# EAGLE design SAO_Genie (EAGLE 7.7.0)
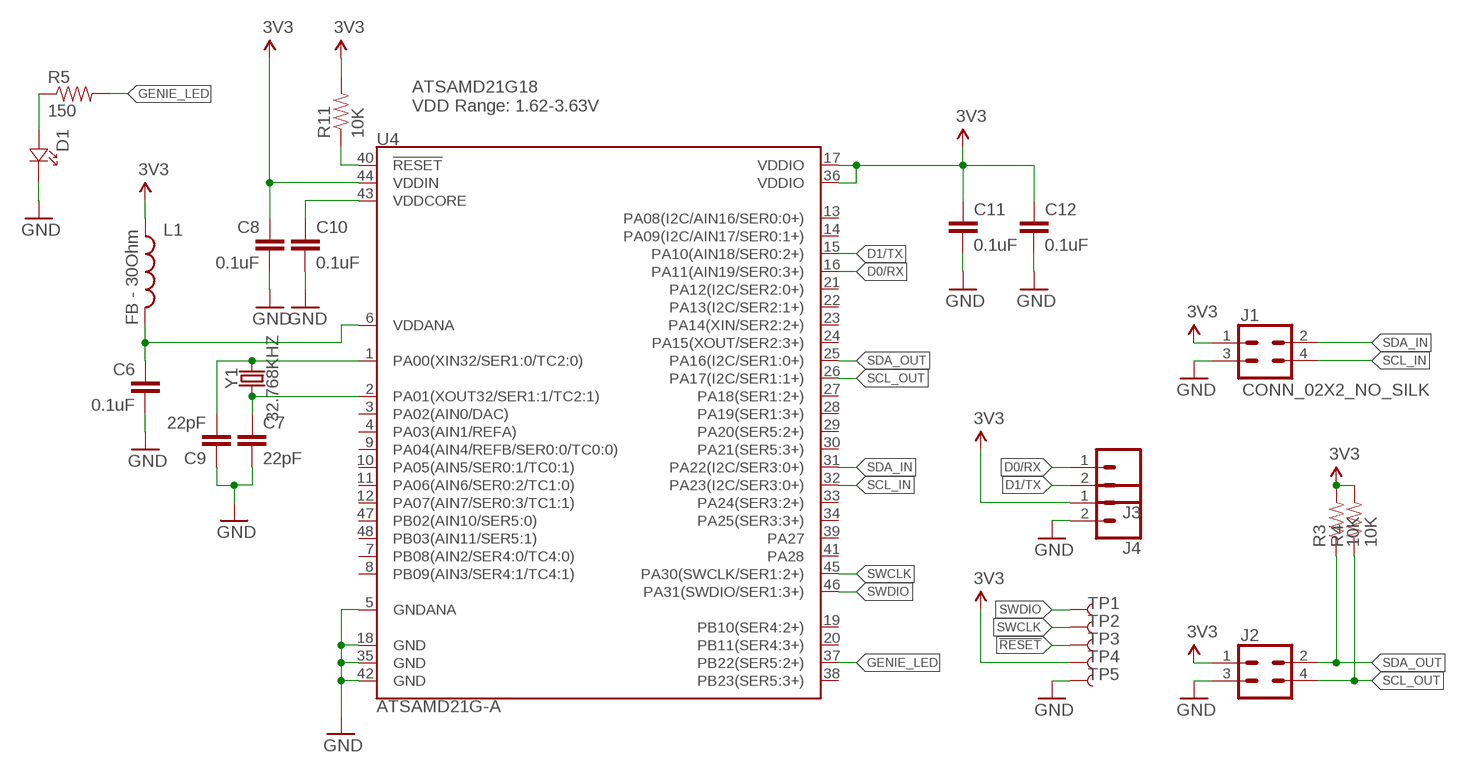
[diagram p0: schematic, sheet 1]

## Parts
C6  0.1uF  0.1UF-25V(+80/-20%)(0603)  [0603-CAP]
C7  22pF  15PF-50V-5%(0603)  [0603-CAP]
C8  0.1uF  0.1UF-25V(+80/-20%)(0603)  [0603-CAP]
C9  22pF  15PF-50V-5%(0603)  [0603-CAP]
C10  0.1uF  0.1UF-25V(+80/-20%)(0603)  [0603-CAP]
C11  0.1uF  0.1UF-25V(+80/-20%)(0603)  [0603-CAP]
C12  0.1uF  0.1UF-25V(+80/-20%)(0603)  [0603-CAP]
D1  LED1206REVERSE_NO_SILK  [1206_NO_SILK]
J1  CONN_02X2_NO_SILK  [2X2_NO_SILK]
J2  SAO OUT  CONN_02X2_NO_SILK  [2X2_NO_SILK]
J3  CONN_021X02_NO_SILK  [1X02_NO_SILK]
J4  CONN_021X02_NO_SILK  [1X02_NO_SILK]
L1  FB - 30Ohm  INDUCTOR0603  [0603]
R3  10K  10KOHM-1/10W-1%(0603)0603  [0603-RES]
R4  10K  10KOHM-1/10W-1%(0603)0603  [0603-RES]
R5  150  10KOHM-1/10W-1%(0603)0603  [0603-RES]
R11  10K  10KOHM-1/10W-1%(0603)0603  [0603-RES]
TP1  TEST-POINT3X5  [PAD.03X.05]
TP2  TEST-POINT3X5  [PAD.03X.05]
TP3  TEST-POINT3X5  [PAD.03X.05]
TP4  TEST-POINT3X5  [PAD.03X.05]
TP5  TEST-POINT3X5  [PAD.03X.05]
U4  ATSAMD21G-A  [TQFP-48]
Y1  32.768KHZ  ABS06-127-32.768KHZ  [ABS06]

## Nets
3.3V: C8.1 C11.1 C12.1 J1.1 J2.1 J4.1 L1.1 R3.2 R4.2 R11.2 TP4.P$1 U4.17(VDDIO) U4.36(VDDIO) U4.44(VDDIN) ; supply symbol labelled 3V3
!RESET: R11.1 TP3.P$1 U4.40(!RESET!)
D0/RX: J3.1 U4.16(PA11(AIN19/SER0:3+))
D1/TX: J3.2 U4.15(PA10(AIN18/SER0:2+))
GENIE_LED: R5.2 U4.37(PB22(SER5:2+))
GND: C6.2 C7.2 C8.2 C9.1 C10.2 C11.2 C12.2 D1.P$1 J1.3 J2.3 J4.2 TP5.P$1 U4.5(GNDANA) U4.18(GND) U4.35(GND) U4.42(GND)
N$2: C7.1 U4.2(PA01(XOUT32/SER1:1/TC2:1)) Y1.P$1
N$5: D1.P$2 R5.1
N$9: C9.2 U4.1(PA00(XIN32/SER1:0/TC2:0)) Y1.P$2
SCL_IN: J1.4 U4.32(PA23(I2C/SER3:0+))
SCL_OUT: J2.4 R4.1 U4.26(PA17(I2C/SER1:1+))
SDA_IN: J1.2 U4.31(PA22(I2C/SER3:0+))
SDA_OUT: J2.2 R3.1 U4.25(PA16(I2C/SER1:0+))
SWCLK: TP2.P$1 U4.45(PA30(SWCLK/SER1:2+))
SWDIO: TP1.P$1 U4.46(PA31(SWDIO/SER1:3+))
VDDANA: C6.1 L1.2 U4.6(VDDANA)
VDDCORE: C10.1 U4.43(VDDCORE)
Unconnected: U4.3(PA02(AIN0/DAC)) U4.4(PA03(AIN1/REFA)) U4.7(PB08(AIN2/SER4:0/TC4:0)) U4.8(PB09(AIN3/SER4:1/TC4:1)) U4.9(PA04(AIN4/REFB/SER0:0/TC0:0)) U4.10(PA05(AIN5/SER0:1/TC0:1)) U4.11(PA06(AIN6/SER0:2/TC1:0)) U4.12(PA07(AIN7/SER0:3/TC1:1)) U4.13(PA08(I2C/AIN16/SER0:0+)) U4.14(PA09(I2C/AIN17/SER0:1+)) U4.19(PB10(SER4:2+)) U4.20(PB11(SER4:3+)) U4.21(PA12(I2C/SER2:0+)) U4.22(PA13(I2C/SER2:1+)) U4.23(PA14(XIN/SER2:2+)) U4.24(PA15(XOUT/SER2:3+)) U4.27(PA18(SER1:2+)) U4.28(PA19(SER1:3+)) U4.29(PA20(SER5:2+)) U4.30(PA21(SER5:3+)) U4.33(PA24(SER3:2+)) U4.34(PA25(SER3:3+)) U4.38(PB23(SER5:3+)) U4.39(PA27) U4.41(PA28) U4.47(PB02(AIN10/SER5:0)) U4.48(PB03(AIN11/SER5:1))

## Notes on the sheet
- ATSAMD21G18
  VDD Range: 1.62-3.63V

## Library data of the parts
C6 C8 C10-C12 = SparkFun-Capacitors:0.1UF-25V(+80/-20%)(0603): CAP-00810 Ceramic Standard decoupling cap; PROD_ID: CAP-00810
C7 C9 = SparkFun-Capacitors:15PF-50V-5%(0603): CAP-07881; PROD_ID: CAP-07881; VALUE: 15pF
D1 = IDEO-Diodes:LED1206
J1 J2 = SparkFun-Connectors:CONN_02X2
J3 J4 = SparkFun-Connectors:CONN_02: Multi connection point. Often used as Generic Header-pin footprint for 0.1 inch spaced/style header connections On any of the 0.1 inch spaced packages, you can populate with these: Break Away Headers - Straight <https://www.sparkfun.com/products/116> (PRT-00116) Break Away Male Headers - Right Angle <https://www.sparkfun.com/products/553> (PRT-00553) Female Headers <https://www.sparkfun.com/products/115> (PRT-00115) Break Away Headers - Machine Pin <https://www.sparkfun.com/products/117> (PRT-00117) Break Away Female Headers - Swiss Machine Pin <https://www.sparkfun.com/products/743> (PRT-00743) For SCREWTERMINALS and SPRING TERMINALS visit here: Screw Terimnals on SparkFun.com <https://www.sparkfun.com/search/results?term=Screw+Terminals> (5mm/3.5mm/2.54mm spacing) This device is also useful as a general connection point to wire up your design to another part of your project. Our various solder wires solder well into these plated through hole pads. Hook-Up Wire - Assortment (Stranded, 22 AWG) <https://www.sparkfun.com/products/11375> (PRT-11375) Hook-Up Wire - Assortment (Solid Core, 22 AWG) <https://www.sparkfun.com/products/11367> (PRT-11367) View the entire wire category on our website here <https://www.sparkfun.com/categories/141> Special notes: Molex polarized connector foot print use with: PRT-08233 with associated crimp pins and housings. 2.54_SCREWTERM for use with PRT-10571. 3.5mm Screw Terminal footprints for PRT-08084 5mm Screw Terminal footprints for use with PRT-08432
L1 = SparkFun-Passives:INDUCTOR: Inductors Basic Inductor/Choke - 0603 and 1206. Footprints are not proven and vary greatly between part numbers. INDUCTOR POWER 3.3UH 4.0A SMD 0.197" L x 0.197" W x 0.177" H (5.00mm x 5.00mm x 4.50mm); PROD_ID: RES-07859
R3 R4 R11 = SparkFun-Resistors:10KOHM-1/10W-1%(0603): RES-00824; PROD_ID: RES-00824
R5 = SparkFun-Resistors:10KOHM-1/10W-1%(0603): RES-00824; PROD_ID: RES-00824; VALUE: 10K
TP1-TP5 = SparkFun-Connectors:TEST-POINT: SparkFun Test Points Bare copper test points for troubleshooting or In-Circuit-Testing. These are used by our Production team for verifying production board runs using pogo-pins on test beds. SparkFun Products: SparkFun LSM9DS1 Breakout <https://www.sparkfun.com/products/13284> SparkFun PSOC <https://www.sparkfun.com/products/13714> SparkFun Load Cell Amplifier <https://www.sparkfun.com/products/13879>
U4 = samd21-temp:ATSAMD21G: Atmel SAMD21G SMART ARM-Based Microcontroller The Atmel ® | SMART ™ SAM D21 is a series of low-power microcontrollers using the 32-bit ARM ® Cortex ® -M0+ processor, and ranging from 32- to 64-pins with up to 256KB Flash and 32KB of SRAM. The SAM D21 devices operate at a maximum frequency of 48MHz and reach 2.46 CoreMark/MHz. They are designed for simple and intuitive migration with identical peripheral modules, hex compatible code, identical linear address map and pin compatible migration paths between all devices in the product series. All devices include intelligent and flexible peripherals, Atmel Event System for inter-peripheral signaling, and support for capacitive touch button, slider and wheel user interfaces.; PROD_ID: IC-13064
Y1 = IDEO-Clocks:ABS06-127-32.768KHZ

## Board
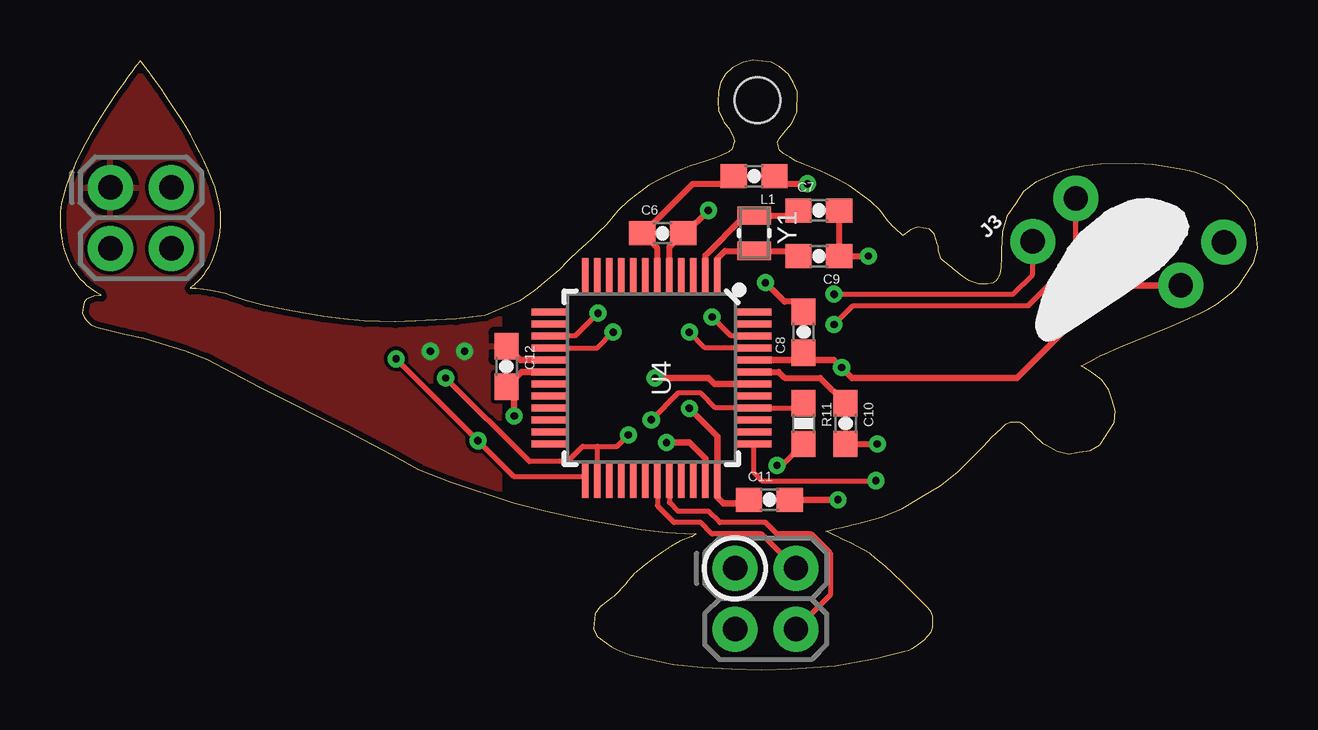
[diagram p1: board, top side]
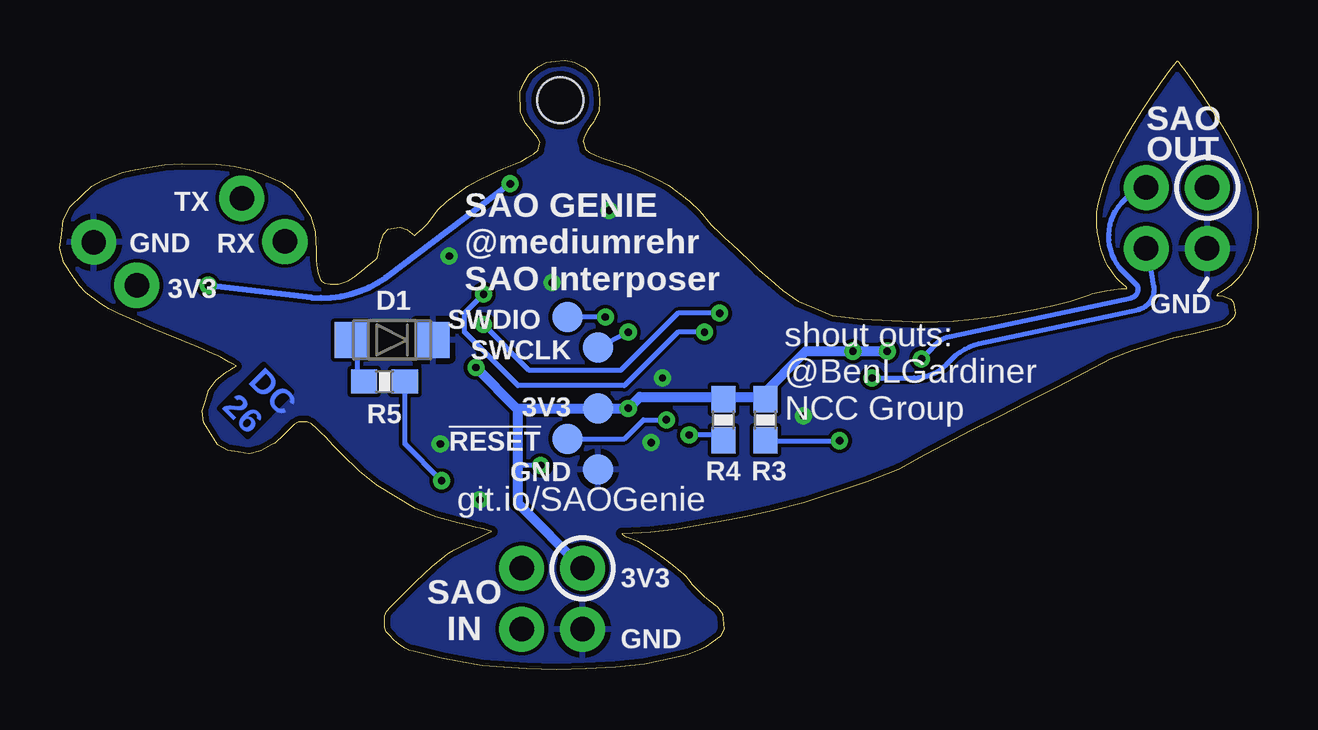
[diagram p2: board, bottom side, seen from below]

Size 49.92 x 25.43 mm. Coordinates in mm from the lower left corner, seen from the top.
Outline: 48.6,20.16 48.18,20.41 47.73,20.58 47.28,20.75 46.8,20.86 46.3,20.94 45.56,21.06 44.83,21.11 43.39,21.08 42.67,21 41.94,20.83 41.85,20.81 41.76,20.78 41.58,20.72 41.49,20.69 41.41,20.65 40.68,20.33 40.16,19.94 39.81,19.42 39.47,18.91 39.29,18.28 39.25,17.5 39.24,17.28 39.25,17.08 39.23,16.89 39.21,16.74 39.17,16.53 39.13,16.42 39.08,16.29 39.01,16.21 38.88,16.13 38.66,16.08 38.56,16.08 38.31,16.1 38.05,16.16 37.89,16.22 37.63,16.4 37.35,16.63 37.07,16.86 36.78,17.09 36.74,17.12 36.71,17.18 36.69,17.24 36.67,17.3 36.65,17.36 36.63,17.42 36.62,17.47 36.61,17.53 36.61,17.64 36.6,17.7 36.58,17.76 36.44,18.16 36.24,18.37 36,18.42 35.75,18.47 35.46,18.35 35.14,18.11 35.03,18.21 34.92,18.3 34.81,18.4 34.71,18.51 34.61,18.61 34.52,18.72 34.17,19.17 33.78,19.54 32.93,20.17 32.46,20.43 31.96,20.67 31.71,20.79 31.45,20.89 30.94,21.1 30.69,21.21 30.46,21.35 30.16,21.52 29.98,21.66 29.91,22 30.01,22.2 30.26,22.5 30.51,22.8 30.71,23.26 30.75,24.1 30.58,24.48 30.36,24.84 29.99,25.14 29.64,25.33 29.26,25.38 28.88,25.43 28.48,25.33 28.03,25.11 27.74,24.83 27.52,24.48 27.45,24.1 27.43,23.7 27.45,23.31 27.64,22.91 27.68,22.84 27.73,22.78 27.78,22.71 27.83,22.65 27.88,22.58 27.91,22.52 28.05,22.25 28.11,22.05 28.02,21.71 27.86,21.58 27.55,21.45 27.24,21.32 26.92,21.22 26.59,21.11 26.27,21 25.94,20.89 25.6,20.73 25.03,20.47 24.56,20.21 24.12,19.88 23.67,19.54 23.25,19.14 22.78,18.57 22.72,18.5 22.48,18.27 22.2,18 21.92,17.74 21.6,17.45 21.17,17.06 20.79,16.66 20.29,16.24 19.79,15.82 19.16,15.37 18.44,15.08 17.73,14.78 16.5,14.62 15.24,14.56 13.98,14.5 12.68,14.54 11.83,14.64 10.98,14.74 10.13,14.87 9.33,15.03 8.54,15.19 7.79,15.37 7.17,15.59 6.88,15.69 6.59,15.76 6.29,15.81 5.99,15.86 5.68,15.89 5.45,15.89 5.46,15.93 5.49,15.98 5.61,16.07 5.66,16.12 5.71,16.17 5.87,16.31 6,16.48 6.12,16.66 6.24,16.84 6.35,17.05 6.43,17.27 6.52,17.49 6.58,17.73 6.63,17.98 6.67,18.24 6.69,18.52 6.69,19.11 6.64,19.44 6.46,20.12 6.33,20.48 6.17,20.85 6.01,21.21 5.83,21.58 5.64,21.94 5.44,22.3 5.23,22.66 5.02,23 4.81,23.34 4.6,23.65 4.41,23.94 4.21,24.23 4.03,24.49 3.87,24.71 3.71,24.92 3.58,25.1 3.49,25.22 3.4,25.34 3.35,25.4 3.29,25.34 3.2,25.22 3.11,25.1 2.98,24.92 2.82,24.71 2.67,24.49 2.48,24.23 2.29,23.94 2.09,23.65 1.88,23.34 1.67,23 1.46,22.66 1.25,22.3 1.06,21.94 0.86,21.58 0.68,21.21 0.52,20.85 0.37,20.48 0.23,20.12 0.05,19.44 0,19.11 0,18.52 0.02,18.24 0.07,17.98 0.11,17.73 0.18,17.49 0.26,17.27 0.35,17.05 0.45,16.84 0.57,16.66 0.69,16.48 0.83,16.31 0.98,16.17 1.1,16.05 1.24,15.94 1.52,15.76 1.67,15.68 1.7,15.61 1.62,15.61 1.43,15.59 1.28,15.53 1.12,15.46 1.01,15.34 0.98,15.13 0.93,14.88 1,14.68 1.14,14.54 1.29,14.39 1.5,14.29 1.76,14.23 2.68,14.01 3.49,13.84 5.21,13.31 6.11,12.96 7.22,12.38 8.33,11.79 9.58,11.17 10.75,10.57 11.93,9.97 13.04,9.41 13.87,8.96 14.95,8.37 16.29,7.83 18.93,6.95 20.24,6.62 21.26,6.4 22.01,6.25 22.59,6.14 23.63,5.95 24.22,5.86 25.31,5.72 26.05,5.69 26.5,5.67 26.45,5.63 26.39,5.59 26.34,5.55 26.3,5.54 25.85,5.37 25.47,5.15 25.1,4.9 24.74,4.66 24.39,4.38 24.03,4.09 23.93,4 23.84,3.9 23.66,3.68 23.58,3.57 23.49,3.47 23.39,3.37 23.29,3.27 23.19,3.17 23.08,3.07 22.97,2.97 22.86,2.89 22.51,2.64 22.3,2.33 22.24,1.71 22.39,1.4 22.76,1.13 22.99,0.96 23.24,0.83 23.77,0.63 24.04,0.56 24.31,0.5 25.55,0.24 26.77,0.1 28,0.05 29.23,0 30.46,0.04 31.72,0.13 32.31,0.18 32.88,0.26 33.45,0.38 34.02,0.49 34.59,0.63 35.17,0.77 35.36,0.82 35.54,0.9 35.7,1.01 35.87,1.12 36.02,1.26 36.17,1.42 36.32,1.58 36.39,1.8 36.39,2.01 36.39,2.23 36.31,2.45 36.14,2.62 35.78,2.97 35.44,3.32 35.09,3.67 34.74,4.01 34.38,4.34 33.99,4.66 33.75,4.85 33.49,5 32.94,5.28 32.65,5.41 32.38,5.56 32.32,5.59 32.24,5.63 32.16,5.67 32.07,5.71 31.99,5.74 31.93,5.77 32.14,5.83 32.37,5.89 32.6,5.95 32.83,6 33.07,6.06 33.27,6.12 34.26,6.38 35.12,6.74 35.92,7.21 36.71,7.68 37.44,8.26 38.15,8.98 38.34,9.16 38.51,9.34 38.85,9.71 39.03,9.89 39.23,10.07 39.43,10.25 39.61,10.34 39.8,10.33 39.98,10.33 40.17,10.23 40.37,10.03 40.48,9.92 40.6,9.79 40.72,9.68 40.84,9.56 40.97,9.45 41.11,9.37 41.56,9.12 42.04,9.01 42.49,9.08 42.94,9.14 43.35,9.38 43.94,10.31 43.98,10.79 43.85,11.23 43.72,11.68 43.42,12.08 43.01,12.4 42.96,12.44 42.88,12.49 42.8,12.53 42.72,12.58 42.63,12.62 42.58,12.66 42.73,12.74 42.89,12.84 43.21,13.02 43.37,13.1 43.53,13.17 44.18,13.47 44.85,13.74 45.51,14.01 46.18,14.28 46.84,14.56 47.49,14.87 47.86,15.04 48.21,15.25 48.84,15.74 49.13,16.03 49.36,16.38 49.76,16.97 49.92,17.59 49.86,18.17 49.79,18.76 49.5,19.32 48.97,19.81 48.6,20.16
Copper layers (1*16): Top 0.035mm / dielectric 1.5mm / Bottom 0.035mm
Design rules "default *": minimum track width 6mil, minimum drill 12mil, track to track 6mil, track to pad 6mil, pad to pad 6mil, via to via 6mil, smd to smd 6mil, copper to edge 10mil, drill to drill 8mil, minimum pad ring 10mil, minimum via ring 8mil, stop-mask expansion 4mil, vias tented up to drill 13mil, thermal gap 10mil
Holes 1.91 mm at 29.07,23.76

### Footprints (pad centres in the part's own frame; a part is rotated, then mirrored left to right if it is on the bottom)
0603-CAP = smd 1.1 x 1: 1 -0.85,0; 2 0.85,0
1206_NO_SILK = smd 1.4 x 1.5: P$1 -1.7,0; P$2 1.7,0
2X2_NO_SILK = drill 1.016 pad 1.88: 1 1.27,1.27; 2 1.27,3.81; 3 3.81,1.27; 4 3.81,3.81
1X02_NO_SILK = drill 1.016 pad 1.88: 1 0,0; 2 2.54,0
0603 = smd 1.1 x 1: 1 -0.85,0; 2 0.85,0
0603-RES = smd 1.1 x 1: 1 -0.85,0; 2 0.85,0
PAD.03X.05 = smd 1.27 x 1.27: P$1 0,0
TQFP-48 = smd 1.5 x 0.28: 1 -4.25,2.75; 2 -4.25,2.25; 3 -4.25,1.75; 4 -4.25,1.25; 5 -4.25,0.75; 6 -4.25,0.25; 7 -4.25,-0.25; 8 -4.25,-0.75; 9 -4.25,-1.25; 10 -4.25,-1.75; 11 -4.25,-2.25; 12 -4.25,-2.75; 25 4.25,-2.75; 26 4.25,-2.25; 27 4.25,-1.75; 28 4.25,-1.25; 29 4.25,-0.75; 30 4.25,-0.25; 31 4.25,0.25; 32 4.25,0.75; 33 4.25,1.25; 34 4.25,1.75; 35 4.25,2.25; 36 4.25,2.75 | smd 0.28 x 1.5: 13 -2.75,-4.25; 14 -2.25,-4.25; 15 -1.75,-4.25; 16 -1.25,-4.25; 17 -0.75,-4.25; 18 -0.25,-4.25; 19 0.25,-4.25; 20 0.75,-4.25; 21 1.25,-4.25; 22 1.75,-4.25; 23 2.25,-4.25; 24 2.75,-4.25; 37 2.75,4.25; 38 2.25,4.25; 39 1.75,4.25; 40 1.25,4.25; 41 0.75,4.25; 42 0.25,4.25; 43 -0.25,4.25; 44 -0.75,4.25; 45 -1.25,4.25; 46 -1.75,4.25; 47 -2.25,4.25; 48 -2.75,4.25
ABS06 = smd 0.762 x 1.397: P$1 -0.737,0; P$2 0.737,0

### Placement (x,y rotation side)
C6  25.12,18.21 0 top
C7  31.63,19.16 0 top
C8  31,14.08 90 top
C9  31.63,17.25 180 top
C10  32.74,10.27 270 top
C11  29.57,7.09 0 top
C12  18.61,12.65 270 top
D1  36.08,13.76 180 bottom
J1  26.87,5.51 270 top
J2  0.83,21.38 270 top
J3  40.55,17.86 45 top
J4  46.72,16.03 45 top
L1  28.93,20.59 180 top
R3  20.52,10.43 90 bottom
R4  22.26,10.43 90 bottom
R5  36.39,12.01 0 bottom
R11  31,10.27 270 top
TP1  28.77,14.71 0 bottom
TP2  27.5,13.44 0 bottom
TP3  28.77,9.63 0 bottom
TP4  27.5,10.9 0 bottom
TP5  27.5,8.36 0 bottom
U4  24.65,12.17 270 top
Y1  28.93,18.21 270 top

### Tracks (layer width: path | path; a pad name or v marks a point on that pad's centre or on a via)
3.3V  (via drill 0.3)
  Top 0.203: R11.2 30.1,8.52 v29.88,8.52
  Top 0.254: L1.1 29.78,20.53 30.04,20.27 v31.15,20.27
  Top 0.279: U4.44 31,12.92 | C8.1 31.01,13.23 31,12.92 | J4.1 v43.75,16.03 39.89,12.17 33.02,12.17 v32.58,12.61 32.27,12.92 31,12.92 | U4.17 19.19,12.92 C12.1 | C11.1 28.56,6.93 27.66,6.93 27.4,7.2 U4.36 27.4,9.74 v26.23,10.9
  Bottom 0.203: 27.4,10.8 TP4.P$1 | 21.79,11.38 22.11,11.38 | R4.2 22.26,11.38 | R3.2 20.62,11.38 20.84,11.38 | v29.88,8.52 30.84,8.52
  Bottom 0.254: v31.15,20.27 36.33,16.36 arc41 39.45,15.53 v43.75,16.03
  Bottom 0.406: 30.88,10.9 TP4.P$1 v26.23,10.9 25.76,11.38 22.26,11.38 22.11,11.38 20.84,11.38 20.73,11.38 18.83,13.28 v16.87,13.28 v15.44,13.28 | v32.58,12.61 30.88,10.9 | 30.88,10.9 30.84,10.86 30.84,8.52 30.84,6.93 J1.1
  pour Top: 18.3,16.62 18.3,5.19 -0.75,14.08 -0.75,26.78 8.14,26.78 8.14,16.62
!RESET  (via drill 0.3)
  Top 0.203: R11.1 30.8,10.92 U4.40 27.32,10.92 26.71,11.54 25.76,11.54 v24.65,10.43
  Bottom 0.203: TP3.P$1 26.39,9.63 25.6,10.43 v24.65,10.43
D0/RX  (via drill 0.3)
  Top 0.203: U4.16 22.4,13.42 v23.06,14.08 | J3.1 40.55,16.48 39.73,15.66 v32.27,15.66
  Bottom 0.203: v32.27,15.66 33.06,14.87 33.06,14.08 30.84,11.86 26.39,11.86 24.17,14.08 v23.06,14.08
D1/TX  (via drill 0.3)
  Top 0.203: J3.2 42.34,17.17 40.36,15.19 33.06,15.19 v32.27,14.39 | v22.42,14.87 21.47,13.92 U4.15
  Bottom 0.203: v22.42,14.87 24.17,14.87 26.55,12.49 30.36,12.49 v32.27,14.39
GENIE_LED  (via drill 0.3)
  Top 0.203: U4.37 28.9,8.24 29.25,7.89 v34.01,7.89
  Bottom 0.203: v34.01,7.89 35.54,9.42 R5.2
GND  (via drill 0.3)
  Top 0.254: C10.2 v34.07,9.42 | C8.2 30.58,15.35 30.2,15.35 v29.41,16.14 | U4.5 25.4,17.63 C6.2 | C7.2 C9.1 v33.69,17.25
  Top 0.279: C11.2 v32.42,7.09 | U4.18 19.24,12.42 C12.2 18.61,11.7 18.93,11.54 v18.93,10.58 | U4.35 26.9,8.81 26.23,9.47 v25.28,9.47 | C6.2 26.07,18.21 v27.03,19.16 | U4.42 27.28,11.92 27.03,12.17 v24.8,12.17
  pour Bottom: 3.06,25.51 -0.75,20.43 0.52,13.76 15.91,7.09 23.53,5.03 21.15,1.85 22.42,-0.05 36.71,-0.53 37.35,1.38 34.17,5.66 39.57,9.47 43.54,8.52 45.12,10.11 44.01,12.65 50.84,16.62 49.09,21.54 41.63,21.7 37.66,18.52 31.15,21.86 30.84,25.67 26.87,25.98 26.87,22.17 21.31,18.52 16.55,15.19 7.34,16.14 7.34,21.06 3.69,25.67 3.06,25.67
N$2
  Top 0.254: U4.2 26.9,17.28 28.46,18.84 28.83,19 Y1.P$1 30.56,18.94 C7.1
N$5
  Bottom 0.203: R5.1 37.35,12.01 37.5,12.17 37.5,13.49 D1.P$2
N$9
  Top 0.254: U4.1 27.4,17.15 27.72,17.47 Y1.P$2 30.41,17.47 C9.2
SCL_IN
  Top 0.203: U4.32 25.4,6.98 25.76,6.62 27.03,6.62 27.5,6.14 29.41,6.14 29.88,5.66 31.31,5.66 32.11,4.87 32.11,3.12 J1.4
SCL_OUT  (via drill 0.3)
  Top 0.203: 22.42,7.89 U4.26 22.4,9.31 | v16.07,12.17 19.57,8.68 21.15,8.68 21.79,9.31 22.4,9.31 | 22.4,9.31 23.22,9.31 v23.69,9.79
  Bottom 0.203: J2.4 arc6 4.33,15.98 arc86 4.96,15.03 11.63,13.6 arc-23 12.58,13.13 12.97,12.73 arc45 14.33,12.17 v16.07,12.17 | R4.1 22.26,9.79 v23.69,9.79
SDA_IN
  Top 0.203: U4.31 24.9,6.84 25.6,6.14 26.71,6.14 27.19,5.66 29.25,5.66 J1.2
SDA_OUT  (via drill 0.3)
  Top 0.203: v14.01,12.97 v17.42,9.55 18.93,8.05 21.9,8.05 U4.25
  Bottom 0.203: J2.2 arc-113 5.75,16.78 5.03,16.05 arc105 5.28,15.51 12.74,13.92 arc-45 13.55,13.42 v14.01,12.97 | R3.1 20.52,9.55 v17.42,9.55
SWCLK  (via drill 0.3)
  Top 0.203: U4.45 26.89,13.42 v26.23,14.08
  Bottom 0.203: v26.23,14.08 TP2.P$1
SWDIO  (via drill 0.3)
  Top 0.203: U4.46 27.98,13.92 v27.19,14.71
  Bottom 0.203: v27.19,14.71 TP1.P$1
VDDANA
  Top 0.203: 27.66,20.27 27.76,20.27 L1.2
  Top 0.254: U4.6 24.9,17.58 C6.1 24.33,18.21 26.39,20.27 27.66,20.27
VDDCORE
  Top 0.254: U4.43 29.95,12.42 30.2,12.17 31.69,12.17 C10.1

### Text on the board
Bottom: DC / 26
bPlace: SAO | OUT | TX | RX | GND | SAO GENIE / @mediumrehr / SAO Interposer | GND | SWDIO | 3V3 | SWCLK | 3V3 | shout outs: / @BenLGardiner / NCC Group | !RESET | GND | git.io/SAOGenie | 3V3 | SAO / IN | GND